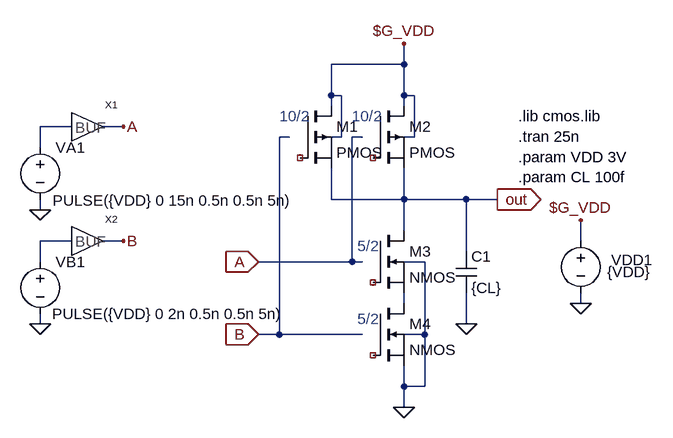
[diagram p0: schematic nand-size-1.asc]
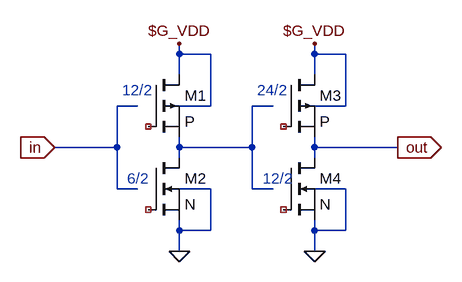
[diagram p1: sub-circuit buf.asc]
nand-size-1.asc, the LTspice schematic file:
Version 4
SHEET 1 1292 680
WIRE -1184 -416 -1184 -448
WIRE -1184 -416 -1296 -416
WIRE -1296 -368 -1296 -416
WIRE -1280 -368 -1296 -368
WIRE -1184 -368 -1184 -416
WIRE -1168 -368 -1184 -368
WIRE -1296 -352 -1296 -368
WIRE -1184 -352 -1184 -368
WIRE -1696 -320 -1744 -320
WIRE -1616 -320 -1648 -320
WIRE -1360 -304 -1376 -304
WIRE -1280 -304 -1280 -368
WIRE -1280 -304 -1296 -304
WIRE -1248 -304 -1264 -304
WIRE -1168 -304 -1168 -368
WIRE -1168 -304 -1184 -304
WIRE -1744 -288 -1744 -320
WIRE -1296 -208 -1296 -256
WIRE -1184 -208 -1184 -256
WIRE -1184 -208 -1296 -208
WIRE -1088 -208 -1184 -208
WIRE -1040 -208 -1088 -208
WIRE -1744 -192 -1744 -208
WIRE -1184 -160 -1184 -208
WIRE -1696 -144 -1744 -144
WIRE -1616 -144 -1648 -144
WIRE -912 -144 -912 -176
WIRE -1088 -128 -1088 -208
WIRE -1744 -112 -1744 -144
WIRE -1264 -112 -1264 -304
WIRE -1264 -112 -1408 -112
WIRE -1248 -112 -1264 -112
WIRE -1152 -112 -1184 -112
WIRE -1184 -48 -1184 -64
WIRE -912 -48 -912 -64
WIRE -1744 -16 -1744 -32
WIRE -1088 -16 -1088 -64
WIRE -1376 0 -1376 -304
WIRE -1376 0 -1408 0
WIRE -1248 0 -1376 0
WIRE -1152 0 -1152 -112
WIRE -1152 0 -1184 0
WIRE -1184 80 -1184 48
WIRE -1152 80 -1152 0
WIRE -1152 80 -1184 80
WIRE -1184 112 -1184 80
FLAG -1184 112 0
FLAG -1040 -208 out
IOPIN -1040 -208 Out
FLAG -1184 -448 $G_VDD
FLAG -1408 -112 A
IOPIN -1408 -112 In
FLAG -1408 0 B
IOPIN -1408 0 In
FLAG -1744 -192 0
FLAG -1616 -320 A
FLAG -1744 -16 0
FLAG -1616 -144 B
FLAG -912 -48 0
FLAG -912 -176 $G_VDD
FLAG -1088 -16 0
SYMBOL pmos -1232 -352 R0
SYMATTR InstName M2
SYMATTR Value2 l=0.6u w=3u
SYMATTR SpiceModel ""
SYMATTR Value PMOS
SYMBOL nmos -1232 -48 R0
SYMATTR InstName M4
SYMATTR Value2 l=0.6u w=1.5u
SYMATTR SpiceModel ""
SYMATTR Value NMOS
SYMBOL pmos -1344 -352 R0
SYMATTR InstName M1
SYMATTR Value2 l=0.6u w=3u
SYMATTR SpiceModel ""
SYMATTR Value PMOS
SYMBOL nmos -1232 -160 R0
SYMATTR InstName M3
SYMATTR Value2 l=0.6u w=1.5u
SYMATTR SpiceModel ""
SYMATTR Value NMOS
SYMBOL voltage -1744 -304 R0
WINDOW 123 0 0 Left 2
WINDOW 39 0 0 Left 2
WINDOW 3 19 98 Left 2
SYMATTR Value PULSE({VDD} 0 15n 0.5n 0.5n 5n)
SYMATTR InstName VA1
SYMBOL buf -1680 -320 R0
SYMATTR InstName X1
SYMBOL voltage -1744 -128 R0
WINDOW 123 0 0 Left 2
WINDOW 39 0 0 Left 2
WINDOW 3 18 96 Left 2
SYMATTR Value PULSE({VDD} 0 2n 0.5n 0.5n 5n)
SYMATTR InstName VB1
SYMBOL buf -1680 -144 R0
SYMATTR InstName X2
SYMBOL voltage -912 -160 R0
WINDOW 123 0 0 Left 2
WINDOW 39 0 0 Left 2
WINDOW 0 47 45 Left 2
WINDOW 3 41 64 Left 2
SYMATTR InstName VDD1
SYMATTR Value {VDD}
SYMBOL cap -1104 -128 R0
SYMATTR InstName C1
SYMATTR Value {CL}
TEXT -1264 -336 Left 2 ;10/2
TEXT -1376 -336 Left 2 ;10/2
TEXT -1256 -136 Left 2 ;5/2
TEXT -1256 -24 Left 2 ;5/2
TEXT -1008 -336 Left 2 !.lib cmos.lib\n.tran 25n\n.param VDD 3V\n.param CL 100f

buf.asc, the sub-circuit schematic file:
Version 4
SHEET 1 1292 836
WIRE -624 -80 -624 -96
WIRE -576 -80 -624 -80
WIRE -416 -80 -416 -96
WIRE -368 -80 -416 -80
WIRE -624 -48 -624 -80
WIRE -416 -48 -416 -80
WIRE -688 0 -720 0
WIRE -576 0 -576 -80
WIRE -576 0 -624 0
WIRE -480 0 -512 0
WIRE -368 0 -368 -80
WIRE -368 0 -416 0
WIRE -720 64 -720 0
WIRE -720 64 -816 64
WIRE -624 64 -624 48
WIRE -512 64 -512 0
WIRE -512 64 -624 64
WIRE -416 64 -416 48
WIRE -288 64 -416 64
WIRE -624 80 -624 64
WIRE -416 80 -416 64
WIRE -720 128 -720 64
WIRE -688 128 -720 128
WIRE -576 128 -624 128
WIRE -512 128 -512 64
WIRE -480 128 -512 128
WIRE -368 128 -416 128
WIRE -624 192 -624 176
WIRE -576 192 -576 128
WIRE -576 192 -624 192
WIRE -416 192 -416 176
WIRE -368 192 -368 128
WIRE -368 192 -416 192
WIRE -624 224 -624 192
WIRE -416 224 -416 192
FLAG -624 224 0
FLAG -816 64 in
IOPIN -816 64 In
FLAG -288 64 out
IOPIN -288 64 Out
FLAG -624 -96 $G_VDD
FLAG -416 224 0
FLAG -416 -96 $G_VDD
SYMBOL pmos -672 -48 R0
SYMATTR InstName M1
SYMATTR Value2 L=0.6U W=7.2U AS=4.86P AD=13.005P PS=7.2U PD=20.7U
SYMATTR SpiceModel ""
SYMATTR Value P
SYMBOL nmos -672 80 R0
SYMATTR InstName M2
SYMATTR Value2 L=0.6U W=3.6U AS=4.86P AD=7.065P PS=7.2U PD=13.5U
SYMATTR Value N
SYMBOL pmos -464 -48 R0
SYMATTR InstName M3
SYMATTR Value2 l=0.6U w=7.2U ad=13.005P as=4.86P pd=20.7U ps=7.2U m=2
SYMATTR SpiceModel ""
SYMATTR Value P
SYMBOL nmos -464 80 R0
SYMATTR InstName M4
SYMATTR Value2 l=0.6U w=3.6U ad=7.065P as=4.86P pd=13.5U ps=7.2U m=2
SYMATTR Value N
TEXT -712 -24 Left 2 ;12/2
TEXT -704 112 Left 2 ;6/2
TEXT -504 -24 Left 2 ;24/2
TEXT -496 112 Left 2 ;12/2

The netlist it stands for:
* nand-size-1.asc
* M2: PMOS l=0.6u w=3u (symbol pmos not certain, pin order unknown); nets seen at it: $G_VDD, out
* M4: NMOS l=0.6u w=1.5u (symbol nmos not certain, pin order unknown); nets seen at it: 0, N003
* M1: PMOS l=0.6u w=3u (symbol pmos not certain, pin order unknown); nets seen at it: $G_VDD, out
* M3: NMOS l=0.6u w=1.5u (symbol nmos not certain, pin order unknown); nets seen at it: N003, out
VA1 N001 0 PULSE({VDD} 0 15n 0.5n 0.5n 5n)
XX1 N001 A buf
VB1 N002 0 PULSE({VDD} 0 2n 0.5n 0.5n 5n)
XX2 N002 B buf
VDD1 $G_VDD 0 {VDD}
C1 out 0 {CL}

* block symbol definitions
.subckt buf in out
* M1: P L=0.6U W=7.2U AS=4.86P AD=13.005P PS=7.2U PD=20.7U (symbol pmos not certain, pin order unknown); nets seen at it: $G_VDD, N001
* M2: N L=0.6U W=3.6U AS=4.86P AD=7.065P PS=7.2U PD=13.5U (symbol nmos not certain, pin order unknown); nets seen at it: 0, N001
* M3: P l=0.6U w=7.2U ad=13.005P as=4.86P pd=20.7U ps=7.2U m=2 (symbol pmos not certain, pin order unknown); nets seen at it: $G_VDD, out
* M4: N l=0.6U w=3.6U ad=7.065P as=4.86P pd=13.5U ps=7.2U m=2 (symbol nmos not certain, pin order unknown); nets seen at it: 0, out
* 12/2
* 6/2
* 24/2
* 12/2
.ends buf

* 10/2
* 10/2
* 5/2
* 5/2
.lib cmos.lib
.tran 25n
.param VDD 3V
.param CL 100f
.backanno
.end